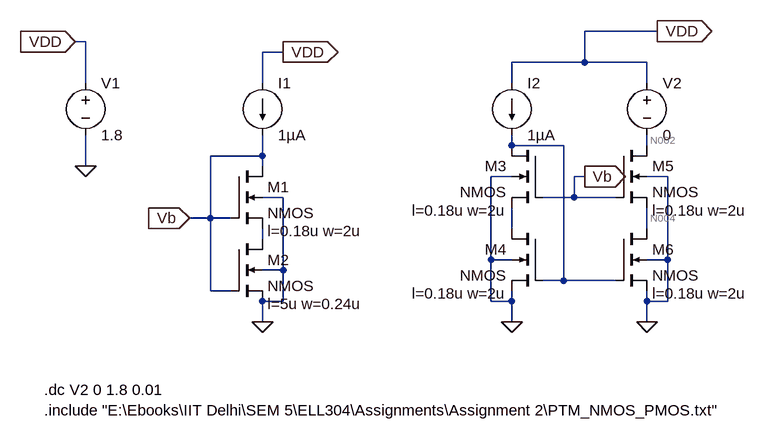
[diagram p0: schematic Q1p2.asc]
Q1p2.asc, the LTspice schematic file:
Version 4
SHEET 1 880 680
WIRE 608 -144 496 -144
WIRE -272 -128 -288 -128
WIRE 32 -112 0 -112
WIRE 496 -96 496 -144
WIRE 496 -96 384 -96
WIRE 592 -96 496 -96
WIRE -272 -64 -272 -128
WIRE 0 -64 0 -112
WIRE 384 -64 384 -96
WIRE 592 -64 592 -96
WIRE 384 32 384 16
WIRE 464 32 384 32
WIRE 592 32 592 16
WIRE 0 48 0 16
WIRE 0 48 -80 48
WIRE -272 64 -272 16
WIRE 0 64 0 48
WIRE 384 80 352 80
WIRE 496 80 480 80
WIRE 624 80 592 80
WIRE 32 112 0 112
WIRE 480 112 480 80
WIRE 480 112 432 112
WIRE 544 112 480 112
WIRE -80 144 -80 48
WIRE -80 144 -112 144
WIRE -48 144 -80 144
WIRE 384 160 384 128
WIRE 592 160 592 128
WIRE 0 176 0 160
WIRE 352 208 352 80
WIRE 384 208 352 208
WIRE 624 208 624 80
WIRE 624 208 592 208
WIRE 32 224 32 112
WIRE 32 224 0 224
WIRE 464 240 464 32
WIRE 464 240 432 240
WIRE 544 240 464 240
WIRE -80 256 -80 144
WIRE -48 256 -80 256
WIRE 32 272 32 224
WIRE 32 272 0 272
WIRE 352 272 352 208
WIRE 384 272 384 256
WIRE 384 272 352 272
WIRE 592 272 592 256
WIRE 624 272 624 208
WIRE 624 272 592 272
WIRE 0 304 0 272
WIRE 384 304 384 272
WIRE 592 304 592 272
FLAG 0 304 0
FLAG -272 64 0
FLAG -288 -128 VDD
IOPIN -288 -128 In
FLAG 32 -112 VDD
IOPIN 32 -112 Out
FLAG 608 -144 VDD
IOPIN 608 -144 Out
FLAG -112 144 Vb
IOPIN -112 144 In
FLAG 384 304 0
FLAG 592 304 0
FLAG 496 80 Vb
IOPIN 496 80 Out
SYMBOL nmos4 -48 64 R0
WINDOW 123 56 100 Left 2
SYMATTR InstName M1
SYMATTR Value2 l=0.18u w=2u
SYMBOL nmos4 -48 176 R0
WINDOW 123 56 100 Left 2
SYMATTR InstName M2
SYMATTR Value2 l=5u w=0.24u
SYMBOL current 0 -64 R0
WINDOW 123 0 0 Left 0
WINDOW 39 0 0 Left 0
SYMATTR InstName I1
SYMATTR Value 1µA
SYMBOL voltage -272 -80 R0
WINDOW 123 0 0 Left 0
WINDOW 39 0 0 Left 0
SYMATTR InstName V1
SYMATTR Value 1.8
SYMBOL nmos4 432 32 M0
WINDOW 123 56 100 Left 2
SYMATTR InstName M3
SYMATTR Value2 l=0.18u w=2u
SYMBOL nmos4 432 160 M0
WINDOW 123 56 100 Left 2
SYMATTR InstName M4
SYMATTR Value2 l=0.18u w=2u
SYMBOL nmos4 544 32 R0
WINDOW 123 56 100 Left 2
SYMATTR InstName M5
SYMATTR Value2 l=0.18u w=2u
SYMBOL nmos4 544 160 R0
WINDOW 123 56 100 Left 2
SYMATTR InstName M6
SYMATTR Value2 l=0.18u w=2u
SYMBOL current 384 -64 R0
WINDOW 123 0 0 Left 0
WINDOW 39 0 0 Left 0
SYMATTR InstName I2
SYMATTR Value 1µA
SYMBOL voltage 592 -80 R0
WINDOW 123 0 0 Left 0
WINDOW 39 0 0 Left 0
SYMATTR InstName V2
SYMATTR Value 0
TEXT -336 440 Left 2 !.include "E:\\Ebooks\\IIT Delhi\\SEM 5\\ELL304\\Assignments\\Assignment 2\\PTM_NMOS_PMOS.txt"
TEXT -336 408 Left 2 !.dc V2 0 1.8 0.01

The netlist it stands for:
* Q1p2.asc
M1 Vb Vb N005 0 NMOS l=0.18u w=2u
M2 N005 Vb 0 0 NMOS l=5u w=0.24u
I1 VDD Vb 1µA
V1 VDD 0 1.8
M3 N001 Vb N003 0 NMOS l=0.18u w=2u
M4 N003 N001 0 0 NMOS l=0.18u w=2u
M5 N002 Vb N004 0 NMOS l=0.18u w=2u
M6 N004 N001 0 0 NMOS l=0.18u w=2u
I2 VDD N001 1µA
V2 VDD N002 0
.model NMOS NMOS
.model PMOS PMOS
.lib standard.mos
.include "E:\Ebooks\IIT Delhi\SEM 5\ELL304\Assignments\Assignment 2\PTM_NMOS_PMOS.txt"
.dc V2 0 1.8 0.01
.backanno
.end

* Results of the author's LTspice run, read from the files saved beside the schematic
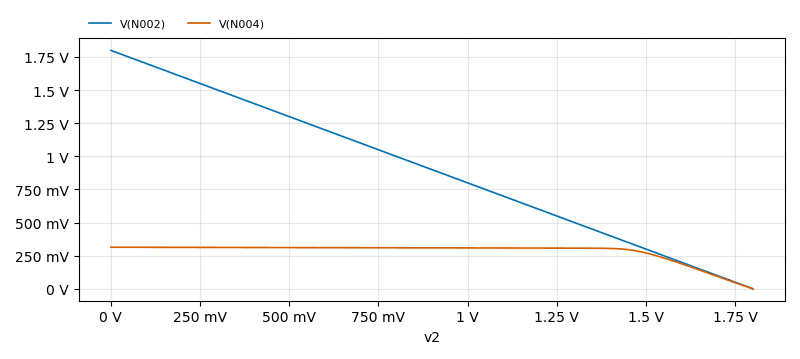
[diagram p1: DC transfer characteristic of Q1p2.asc, plotted from the saved traces]
* DC transfer characteristic, 1 run:
*   V(N002): 1.8 V at v2=0 V, 0 V at v2=1.8 V, min 0 V, max 1.8 V
*   V(N004): 313.9 mV at v2=0 V, -0.3951 fV at v2=1.8 V, min -0.3951 fV, max 313.9 mV